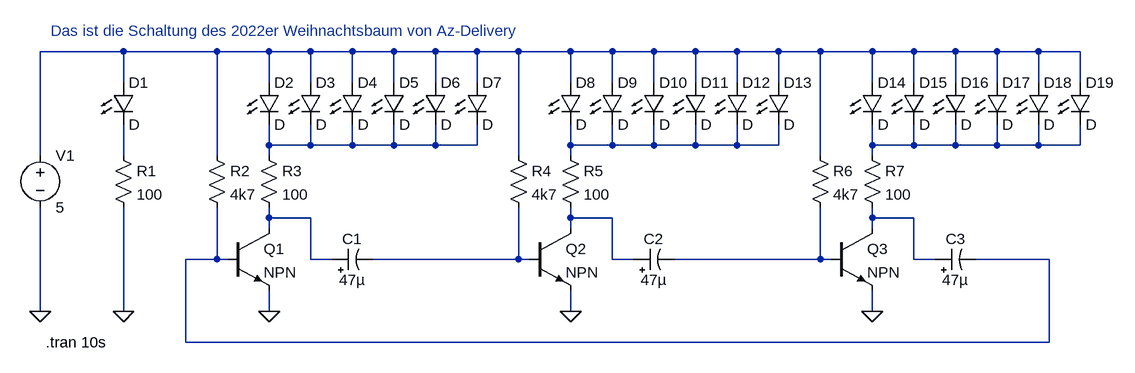
[diagram p0: schematic Lauflicht.asc]
Lauflicht.asc, the LTspice schematic file:
Version 4
SHEET 1 1380 680
WIRE -272 -128 -400 -128
WIRE -128 -128 -272 -128
WIRE -48 -128 -128 -128
WIRE 16 -128 -48 -128
WIRE 80 -128 16 -128
WIRE 144 -128 80 -128
WIRE 208 -128 144 -128
WIRE 272 -128 208 -128
WIRE 336 -128 272 -128
WIRE 416 -128 336 -128
WIRE 480 -128 416 -128
WIRE 544 -128 480 -128
WIRE 608 -128 544 -128
WIRE 672 -128 608 -128
WIRE 736 -128 672 -128
WIRE 800 -128 736 -128
WIRE 880 -128 800 -128
WIRE 944 -128 880 -128
WIRE 1008 -128 944 -128
WIRE 1072 -128 1008 -128
WIRE 1136 -128 1072 -128
WIRE 1200 -128 1136 -128
WIRE -272 -80 -272 -128
WIRE -48 -80 -48 -128
WIRE 16 -80 16 -128
WIRE 80 -80 80 -128
WIRE 144 -80 144 -128
WIRE 208 -80 208 -128
WIRE 272 -80 272 -128
WIRE 416 -80 416 -128
WIRE 480 -80 480 -128
WIRE 544 -80 544 -128
WIRE 608 -80 608 -128
WIRE 672 -80 672 -128
WIRE 736 -80 736 -128
WIRE 880 -80 880 -128
WIRE 944 -80 944 -128
WIRE 1008 -80 1008 -128
WIRE 1072 -80 1072 -128
WIRE 1136 -80 1136 -128
WIRE 1200 -80 1200 -128
WIRE -48 16 -48 -16
WIRE 16 16 16 -16
WIRE 16 16 -48 16
WIRE 80 16 80 -16
WIRE 80 16 16 16
WIRE 144 16 144 -16
WIRE 144 16 80 16
WIRE 208 16 208 -16
WIRE 208 16 144 16
WIRE 272 16 272 -16
WIRE 272 16 208 16
WIRE 416 16 416 -16
WIRE 480 16 480 -16
WIRE 480 16 416 16
WIRE 544 16 544 -16
WIRE 544 16 480 16
WIRE 608 16 608 -16
WIRE 608 16 544 16
WIRE 672 16 672 -16
WIRE 672 16 608 16
WIRE 736 16 736 -16
WIRE 736 16 672 16
WIRE 880 16 880 -16
WIRE 944 16 944 -16
WIRE 944 16 880 16
WIRE 1008 16 1008 -16
WIRE 1008 16 944 16
WIRE 1072 16 1072 -16
WIRE 1072 16 1008 16
WIRE 1136 16 1136 -16
WIRE 1136 16 1072 16
WIRE 1200 16 1200 -16
WIRE 1200 16 1136 16
WIRE -400 32 -400 -128
WIRE -272 32 -272 -16
WIRE -128 32 -128 -128
WIRE -48 32 -48 16
WIRE 336 32 336 -128
WIRE 416 32 416 16
WIRE 800 32 800 -128
WIRE 880 32 880 16
WIRE -48 128 -48 112
WIRE 16 128 -48 128
WIRE 416 128 416 112
WIRE 480 128 416 128
WIRE 880 128 880 112
WIRE 944 128 880 128
WIRE -48 144 -48 128
WIRE 416 144 416 128
WIRE 880 144 880 128
WIRE -128 192 -128 112
WIRE -128 192 -176 192
WIRE -112 192 -128 192
WIRE 16 192 16 128
WIRE 48 192 16 192
WIRE 336 192 336 112
WIRE 336 192 112 192
WIRE 352 192 336 192
WIRE 480 192 480 128
WIRE 512 192 480 192
WIRE 800 192 800 112
WIRE 800 192 576 192
WIRE 816 192 800 192
WIRE 944 192 944 128
WIRE 976 192 944 192
WIRE 1152 192 1040 192
WIRE -400 272 -400 112
WIRE -272 272 -272 112
WIRE -48 272 -48 240
WIRE 416 272 416 240
WIRE 880 272 880 240
WIRE -176 320 -176 192
WIRE 1152 320 1152 192
WIRE 1152 320 -176 320
FLAG -48 272 0
FLAG 416 272 0
FLAG 880 272 0
FLAG -400 272 0
FLAG -272 272 0
SYMBOL npn -112 144 R0
SYMATTR InstName Q1
SYMBOL npn 352 144 R0
SYMATTR InstName Q2
SYMBOL npn 816 144 R0
SYMATTR InstName Q3
SYMBOL res -64 16 R0
SYMATTR InstName R3
SYMATTR Value 100
SYMBOL res 400 16 R0
SYMATTR InstName R5
SYMATTR Value 100
SYMBOL res 864 16 R0
SYMATTR InstName R7
SYMATTR Value 100
SYMBOL LED -64 -80 R0
SYMATTR InstName D2
SYMBOL LED 400 -80 R0
SYMATTR InstName D8
SYMBOL LED 864 -80 R0
SYMATTR InstName D14
SYMBOL polcap 976 208 R270
WINDOW 0 32 32 VTop 2
WINDOW 3 0 32 VBottom 2
SYMATTR InstName C3
SYMATTR Value 47µ
SYMBOL polcap 48 208 R270
WINDOW 0 32 32 VTop 2
WINDOW 3 0 32 VBottom 2
SYMATTR InstName C1
SYMATTR Value 47µ
SYMBOL polcap 512 208 R270
WINDOW 0 32 32 VTop 2
WINDOW 3 0 32 VBottom 2
SYMATTR InstName C2
SYMATTR Value 47µ
SYMBOL res -144 16 R0
SYMATTR InstName R2
SYMATTR Value 4k7
SYMBOL res 320 16 R0
SYMATTR InstName R4
SYMATTR Value 4k7
SYMBOL res 784 16 R0
SYMATTR InstName R6
SYMATTR Value 4k7
SYMBOL voltage -400 16 R0
WINDOW 123 0 0 Left 0
WINDOW 39 0 0 Left 0
SYMATTR InstName V1
SYMATTR Value 5
SYMBOL LED 0 -80 R0
SYMATTR InstName D3
SYMBOL LED 64 -80 R0
SYMATTR InstName D4
SYMBOL LED 128 -80 R0
SYMATTR InstName D5
SYMBOL LED 192 -80 R0
SYMATTR InstName D6
SYMBOL LED 256 -80 R0
SYMATTR InstName D7
SYMBOL LED 464 -80 R0
SYMATTR InstName D9
SYMBOL LED 528 -80 R0
SYMATTR InstName D10
SYMBOL LED 592 -80 R0
SYMATTR InstName D11
SYMBOL LED 720 -80 R0
SYMATTR InstName D13
SYMBOL LED 656 -80 R0
SYMATTR InstName D12
SYMBOL LED 928 -80 R0
SYMATTR InstName D15
SYMBOL LED 992 -80 R0
SYMATTR InstName D16
SYMBOL LED 1056 -80 R0
SYMATTR InstName D17
SYMBOL LED 1120 -80 R0
SYMATTR InstName D18
SYMBOL LED 1184 -80 R0
SYMATTR InstName D19
SYMBOL res -288 16 R0
SYMATTR InstName R1
SYMATTR Value 100
SYMBOL LED -288 -80 R0
SYMATTR InstName D1
TEXT -392 320 Left 2 !.tran 10s
TEXT -384 -160 Left 2 ;Das ist die Schaltung des 2022er Weihnachtsbaum von Az-Delivery

The netlist it stands for:
* Lauflicht.asc
Q1 N006 N009 0 0 NPN
Q2 N007 N010 0 0 NPN
Q3 N008 N011 0 0 NPN
R3 N002 N006 100
R5 N003 N007 100
R7 N004 N008 100
D2 N001 N002 D
D8 N001 N003 D
D14 N001 N004 D
C3 N008 N009 47µ
C1 N006 N010 47µ
C2 N007 N011 47µ
R2 N001 N009 4k7
R4 N001 N010 4k7
R6 N001 N011 4k7
V1 N001 0 5
D3 N001 N002 D
D4 N001 N002 D
D5 N001 N002 D
D6 N001 N002 D
D7 N001 N002 D
D9 N001 N003 D
D10 N001 N003 D
D11 N001 N003 D
D13 N001 N003 D
D12 N001 N003 D
D15 N001 N004 D
D16 N001 N004 D
D17 N001 N004 D
D18 N001 N004 D
D19 N001 N004 D
R1 N005 0 100
D1 N001 N005 D
.model D D
.lib standard.dio
.model NPN NPN
.model PNP PNP
.lib standard.bjt
.tran 10s
* Das ist die Schaltung des 2022er Weihnachtsbaum von Az-Delivery
.backanno
.end